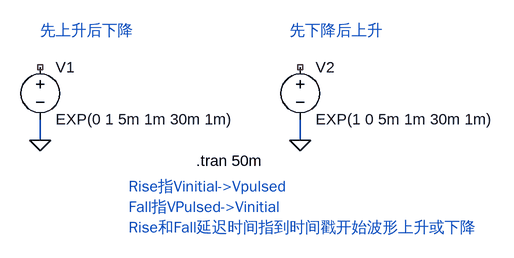
[diagram p0: schematic Draft3.asc]
Draft3.asc, the LTspice schematic file:
Version 4.1
SHEET 1 880 680
WIRE 80 176 80 144
WIRE 480 176 480 144
FLAG 80 176 0
FLAG 480 176 0
SYMBOL voltage 80 48 R0
WINDOW 123 0 0 Left 0
WINDOW 39 0 0 Left 0
SYMATTR InstName V1
SYMATTR Value EXP(0 1 5m 1m 30m 1m)
SYMBOL voltage 480 48 R0
WINDOW 123 0 0 Left 0
WINDOW 39 0 0 Left 0
SYMATTR InstName V2
SYMATTR Value EXP(1 0 5m 1m 30m 1m)
TEXT 80 8 Left 2 ;先上升后下降
TEXT 464 8 Left 2 ;先下降后上升
TEXT 216 248 Left 2 ;Rise指Vinitial->Vpulsed\nFall指VPulsed->Vinitial\nRise和Fall延迟时间指到时间戳开始波形上升或下降
TEXT 320 208 Left 2 !.tran 50m

The netlist it stands for:
* Draft3.asc
V1 NC_01 0 EXP(0 1 5m 1m 30m 1m)
V2 NC_02 0 EXP(1 0 5m 1m 30m 1m)
* 先上升后下降
* 先下降后上升
* Rise指Vinitial->Vpulsed
* Fall指VPulsed->Vinitial
* Rise和Fall延迟时间指到时间戳开始波形上升或下降
.tran 50m
.backanno
.end